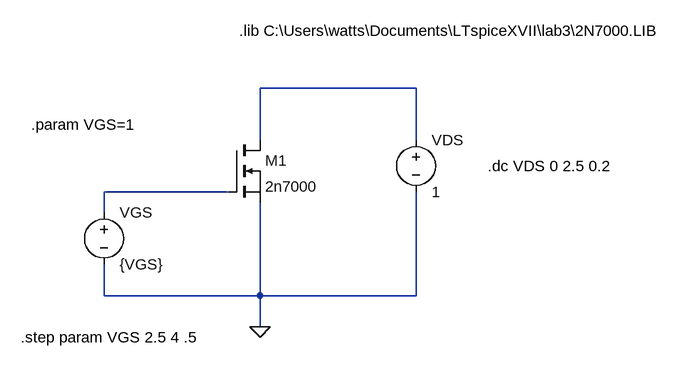
[diagram p0: schematic nmos_2N7000.asc]
nmos_2N7000.asc, the LTspice schematic file:
Version 4
SHEET 1 1024 680
WIRE 432 -16 192 -16
WIRE 192 64 192 -16
WIRE 432 64 432 -16
WIRE 144 144 -48 144
WIRE -48 176 -48 144
WIRE -48 304 -48 256
WIRE 192 304 192 160
WIRE 192 304 -48 304
WIRE 432 304 432 144
WIRE 432 304 192 304
WIRE 192 352 192 304
FLAG 192 352 0
SYMBOL nmos 144 64 R0
SYMATTR InstName M1
SYMATTR Value 2n7000
SYMATTR Prefix X
SYMBOL voltage -48 160 R0
SYMATTR InstName VGS
SYMATTR Value {VGS}
SYMBOL voltage 432 48 R0
SYMATTR InstName VDS
SYMATTR Value 1
TEXT 160 -104 Left 2 !.lib C:\\Users\\watts\\Documents\\LTspiceXVII\\lab3\\2N7000.LIB
TEXT 542 104 Left 2 !.dc VDS 0 2.5 0.2
TEXT -160 40 Left 2 !.param VGS=1
TEXT -176 368 Left 2 !.step param VGS 2.5 4 .5

The netlist it stands for:
* nmos_2N7000.asc
XM1 N001 N002 0 2n7000  ; pins D G S
VGS N002 0 {VGS}
VDS N001 0 1
.lib C:\Users\watts\Documents\LTspiceXVII\lab3\2N7000.LIB
.dc VDS 0 2.5 0.2
.param VGS=1
.step param VGS 2.5 4 .5
.backanno
.end